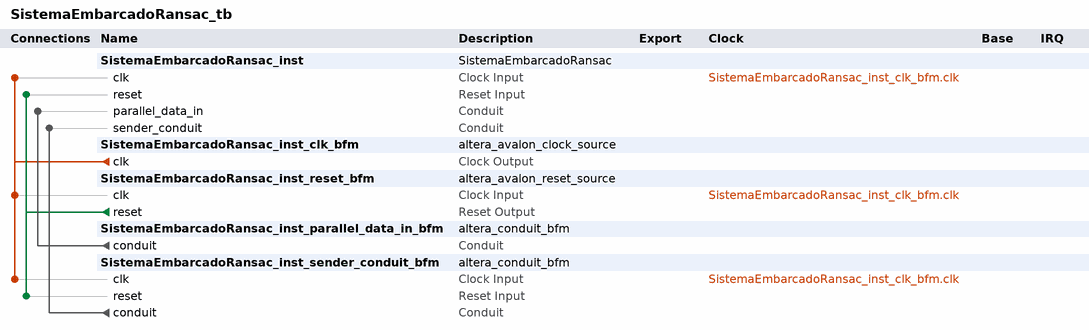
[diagram p0: system contents]
# Platform Designer (Qsys) system SistemaEmbarcadoRansac_tb, Cyclone IV E EP4CE115F29C7
# Parameters at their usual value, and those the tool derives, are not listed.
package require -exact qsys 18.1
create_system SistemaEmbarcadoRansac_tb
set_project_property DEVICE_FAMILY {Cyclone IV E}
set_project_property DEVICE EP4CE115F29C7

add_instance SistemaEmbarcadoRansac_inst SistemaEmbarcadoRansac 1.0

add_instance SistemaEmbarcadoRansac_inst_clk_bfm altera_avalon_clock_source 18.1

add_instance SistemaEmbarcadoRansac_inst_reset_bfm altera_avalon_reset_source 18.1
set_instance_parameter_value SistemaEmbarcadoRansac_inst_reset_bfm ASSERT_HIGH_RESET 0
set_instance_parameter_value SistemaEmbarcadoRansac_inst_reset_bfm INITIAL_RESET_CYCLES 50

add_instance SistemaEmbarcadoRansac_inst_parallel_data_in_bfm altera_conduit_bfm 18.1
set_instance_parameter_value SistemaEmbarcadoRansac_inst_parallel_data_in_bfm CLOCKED_SIGNAL false
set_instance_parameter_value SistemaEmbarcadoRansac_inst_parallel_data_in_bfm ENABLE_RESET false
set_instance_parameter_value SistemaEmbarcadoRansac_inst_parallel_data_in_bfm SIGNAL_DIRECTIONS output
set_instance_parameter_value SistemaEmbarcadoRansac_inst_parallel_data_in_bfm SIGNAL_WIDTHS 32

add_instance SistemaEmbarcadoRansac_inst_sender_conduit_bfm altera_conduit_bfm 18.1
set_instance_parameter_value SistemaEmbarcadoRansac_inst_sender_conduit_bfm CLOCKED_SIGNAL true
set_instance_parameter_value SistemaEmbarcadoRansac_inst_sender_conduit_bfm ENABLE_RESET true
set_instance_parameter_value SistemaEmbarcadoRansac_inst_sender_conduit_bfm SIGNAL_DIRECTIONS input
set_instance_parameter_value SistemaEmbarcadoRansac_inst_sender_conduit_bfm SIGNAL_ROLES readdata
set_instance_parameter_value SistemaEmbarcadoRansac_inst_sender_conduit_bfm SIGNAL_WIDTHS 32

# connections
add_connection SistemaEmbarcadoRansac_inst_clk_bfm.clk SistemaEmbarcadoRansac_inst.clk clock
add_connection SistemaEmbarcadoRansac_inst_clk_bfm.clk SistemaEmbarcadoRansac_inst_reset_bfm.clk clock
add_connection SistemaEmbarcadoRansac_inst_clk_bfm.clk SistemaEmbarcadoRansac_inst_sender_conduit_bfm.clk clock
add_connection SistemaEmbarcadoRansac_inst_reset_bfm.reset SistemaEmbarcadoRansac_inst.reset reset
add_connection SistemaEmbarcadoRansac_inst_reset_bfm.reset SistemaEmbarcadoRansac_inst_sender_conduit_bfm.reset reset
add_connection SistemaEmbarcadoRansac_inst_parallel_data_in_bfm.conduit SistemaEmbarcadoRansac_inst.parallel_data_in conduit
add_connection SistemaEmbarcadoRansac_inst_sender_conduit_bfm.conduit SistemaEmbarcadoRansac_inst.sender_conduit conduit

set_interconnect_requirement {$system} qsys_mm.clockCrossingAdapter HANDSHAKE
set_interconnect_requirement {$system} qsys_mm.enableEccProtection FALSE
set_interconnect_requirement {$system} qsys_mm.insertDefaultSlave FALSE
set_interconnect_requirement {$system} qsys_mm.maxAdditionalLatency 1

save_system SistemaEmbarcadoRansac_tb.qsys
